# EAGLE design FillSensor (EAGLE 6.3)
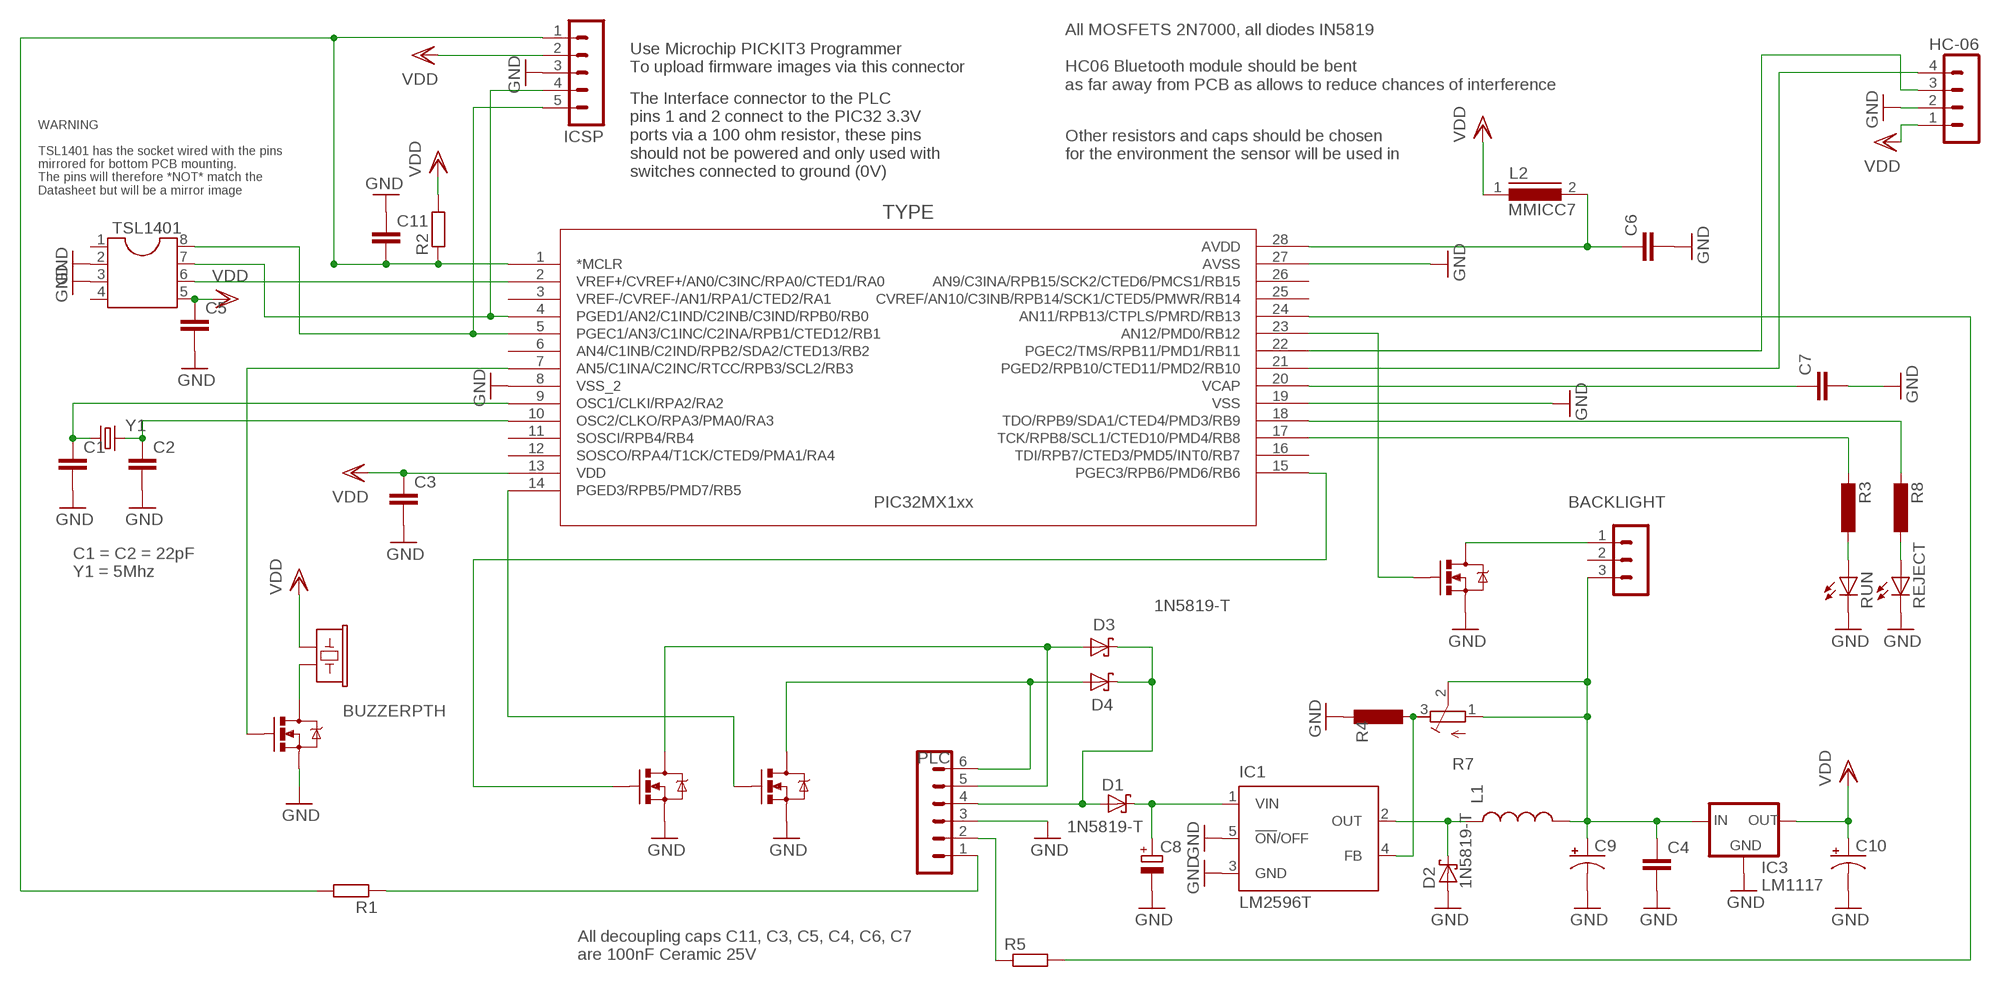
[diagram p0: schematic, sheet 1]

## Parts
BACKLIGHT  MA03-1  [MA03-1]
C1  CAPPTH  [CAP-PTH-SMALL]
C2  CAPPTH  [CAP-PTH-SMALL]
C3  CAPPTH  [CAP-PTH-SMALL]
C4  CAPPTH  [CAP-PTH-SMALL]
C5  CAPPTH  [CAP-PTH-SMALL]
C6  CAPPTH  [CAP-PTH-SMALL]
C7  CAPPTH  [CAP-PTH-SMALL]
C8  CPOL-EUE5-5  [E5-5]
C9  CAP_POLPTH2  [CPOL-RADIAL-10UF-25V]
C10  CAP_POLPTH2  [CPOL-RADIAL-10UF-25V]
C11  CAPPTH  [CAP-PTH-SMALL]
D1  1N5819-T  [DO41-7.6]
D2  1N5819-T  [DO41-7.6]
D3  1N5819-T  [DO41-7.6]
D4  1N5819-T  [DO41-7.6]
HC-06  MA04-1  [MA04-1]
IC1  LM2596T  [T05D]
IC3  LM1117  LM1117DTX-3.3  [TO252]
ICSP  MA05-1  [MA05-1]
L1  INDUCTORPWR  [CDRH125]
L2  MMICC7  [MMICC7]
PLC  MA06-1  [MA06-1]
Q1  MOSFET-NCHANNEL2N7000  [TO-92-AMMO]
Q2  MOSFET-NCHANNEL2N7000  [TO-92-AMMO]
Q3  MOSFET-NCHANNEL2N7000  [TO-92-AMMO]
Q4  MOSFET-NCHANNEL2N7000  [TO-92-AMMO]
R1  R-EU_0207/10  [0207/10]
R2  R-EU_0207/10  [0207/10]
R3  L-EU0207/10  [0207/10]
R4  L-EU0207/10  [0207/10]
R5  R-EU_0207/10  [0207/10]
R7  R-TRIMM64W  [RTRIM64W]
R8  L-EU0207/10  [0207/10]
REJECT  LED5MM  [LED5MM]
RUN  LED5MM  [LED5MM]
SG1  BUZZERPTH  [BUZZER-12MM]
TSL1401  DIL8  [DIL08]
U1  PIC32MX150F128B-  [SPDIP28_300MC]
Y1  CRYSTALHC49UV  [HC49U-V]

## Nets
GND: C1.2 C2.2 C3.2 C4.2 C5.2 C6.2 C7.2 C8.- C9.2(-) C10.2(-) C11.1 D2.A HC-06.2 IC1.3(GND) IC1.5(!ON!/OFF) IC3.1(GND) ICSP.3 PLC.3 Q1.1(S) Q2.1(S) Q3.1(S) Q4.1(S) R4.1 REJECT.K(C) RUN.K(C) TSL1401.2 TSL1401.3 U1.8(VSS_2) U1.19(VSS) U1.27(AVSS)
N$1: C1.1 U1.9(OSC1/CLKI/RPA2/RA2) Y1.1
N$2: C2.1 U1.10(OSC2/CLKO/RPA3/PMA0/RA3) Y1.2
N$3: C6.1 L2.2 U1.28(AVDD)
N$4: C11.2 ICSP.1 R1.2 R2.1 U1.1(*MCLR)
N$5: TSL1401.6 U1.2(VREF+/CVREF+/AN0/C3INC/RPA0/CTED1/RA0)
N$6: R3.1 RUN.A
N$7: ICSP.5 TSL1401.8 U1.5(PGEC1/AN3/C1INC/C2INA/RPB1/CTED12/RB1)
N$8: C7.1 U1.20(VCAP)
N$9: Q3.2(G) U1.23(AN12/PMD0/RB12)
N$11: R5.2 U1.24(AN11/RPB13/CTPLS/PMRD/RB13)
N$12: ICSP.4 TSL1401.7 U1.4(PGED1/AN2/C1IND/C2INB/C3IND/RPB0/RB0)
N$13: R8.1 REJECT.A
N$14: C8.+ D1.C IC1.1(VIN)
N$15: HC-06.3 U1.22(PGEC2/TMS/RPB11/PMD1/RB11)
N$16: IC1.4(FB) R4.2 R7.3(A)
N$18: D4.A PLC.6 Q1.3(D)
N$19: D3.A PLC.5 Q2.3(D)
N$20: Q2.2(G) U1.15(PGEC3/RPB6/PMD6/RB6)
N$21: Q1.2(G) U1.14(PGED3/RPB5/PMD7/RB5)
N$22: BACKLIGHT.3 C4.1 C9.1(+) IC3.2(IN) L1.2 R7.1(E) R7.2(S)
N$23: R3.2 U1.17(TCK/RPB8/SCL1/CTED10/PMD4/RB8)
N$24: R8.2 U1.18(TDO/RPB9/SDA1/CTED4/PMD3/RB9)
N$25: BACKLIGHT.1 Q3.3(D)
N$26: HC-06.4 U1.21(PGED2/RPB10/CTED11/PMD2/RB10)
N$27: Q4.3(D) SG1.-
N$28: Q4.2(G) U1.7(AN5/C1INA/C2INC/RTCC/RPB3/SCL2/RB3)
N$29: D1.A D3.C D4.C PLC.4
N$30: PLC.1 R1.1
N$31: PLC.2 R5.1
TH1: D2.C IC1.2(OUT) L1.1
VDD: C3.1 C5.1 C10.1(+) HC-06.1 IC3.TAB(OUT) ICSP.2 L2.1 R2.2 SG1.+ TSL1401.5 U1.13(VDD)
Unconnected: BACKLIGHT.2 TSL1401.1 TSL1401.4 U1.3(VREF-/CVREF-/AN1/RPA1/CTED2/RA1) U1.6(AN4/C1INB/C2IND/RPB2/SDA2/CTED13/RB2) U1.11(SOSCI/RPB4/RB4) U1.12(SOSCO/RPA4/T1CK/CTED9/PMA1/RA4) U1.16(TDI/RPB7/CTED3/PMD5/INT0/RB7) U1.25(CVREF/AN10/C3INB/RPB14/SCK1/CTED5/PMWR/RB14) U1.26(AN9/C3INA/RPB15/SCK2/CTED6/PMCS1/RB15)

## Notes on the sheet
- Use Microchip PICKIT3 Programmer
  To upload firmware images via this connector
- All MOSFETS 2N7000, all diodes IN5819
  
  HC06 Bluetooth module should be bent
  as far away from PCB as allows to reduce chances of interference
- Other resistors and caps should be chosen 
  for the environment the sensor will be used in
- The Interface connector to the PLC
  pins 1 and 2 connect to the PIC32 3.3V
  ports via a 100 ohm resistor, these pins
  should not be powered and only used with
  switches connected to ground (0V)
- WARNING
  
  TSL1401 has the socket wired with the pins 
  mirrored for bottom PCB mounting. 
  The pins will therefore *NOT* match the
  Datasheet but will be a mirror image
- PIC32MX1xx
- C1 = C2 = 22pF
  Y1 = 5Mhz
- All decoupling caps C11, C3, C5, C4, C6, C7
  are 100nF Ceramic 25V

## Library data of the parts
BACKLIGHT = con-lstb:MA03-1: PIN HEADER; OC_FARNELL: unknown; OC_NEWARK: unknown
C1-C7 C11 = SparkFun:CAP: Capacitor Standard 0603 ceramic capacitor, and 0.1" leaded capacitor.
C8 = rcl:CPOL-EU: POLARIZED CAPACITOR, European symbol
C9 C10 = SparkFun:CAP_POL: Capacitor Polarized These are standard SMD and PTH capacitors. Normally 10uF, 47uF, and 100uF in electrolytic and tantalum varieties. Always verify the external diameter of the through hole cap, it varies with capacity, voltage, and manufacturer. The EIA devices should be standard.
D1-D4 = diode:1N581*: 1.0A SCHOTTKY BARRIER RECTIFIER Source: http://www.diodes.com/datasheets/ds23001.pdf
HC-06 = con-lstb:MA04-1: PIN HEADER; OC_FARNELL: unknown; OC_NEWARK: unknown
IC1 = national-semiconductor:LM2596: SIMPLE SWITCHER® Power Converter 150 kHz 3A Step-Down Voltage Regulator Source: http://www.national.com/ds/LM/LM2596.pdf; MPN: LM2596T-ADJ/LF02; OC_FARNELL: 9494162; OC_NEWARK: 65K5910
IC3 = boznz:LM1117DTX-*
ICSP = con-lstb:MA05-1: PIN HEADER; OC_FARNELL: unknown; OC_NEWARK: unknown
L1 = SparkFun:INDUCTOR: Inductors Basic Inductor/Choke - 0603 and 1206. Footprints are not proven and vary greatly between part numbers.
L2 = inductors:MMICC7: INDUCTOR
PLC = con-lstb2:MA06-1: PIN HEADER; OC_FARNELL: unknown; OC_NEWARK: unknown
Q1-Q4 = SparkFun:MOSFET-NCHANNEL
R1 R2 R5 = rcl:R-EU_: RESISTOR, European symbol
R3 R4 R8 = rcl:L-EU: INDUCTOR, European symbol
R7 = resistor:R-TRIMM: Trimm resistor
REJECT RUN = SparkFun:LED: LEDs Standard schematic elements and footprints for 5mm, 3mm, 1206, and 0603 sized LEDs. 5mm - Spark Fun Electronics SKU : COM-00529 (and others)
SG1 = SparkFun:BUZZER: Buzzer 12mm Spark Fun Electronics SKU : Comp-Buzzer
TSL1401 = ic-package:DIL8: Dual In Line / Socket
U1 = boznz:PIC32MX150F128B-
Y1 = SparkFun:CRYSTAL: Crystals Various standard crystals. Proven footprints. Spark Fun Electronics SKU : COM-00534

## Board
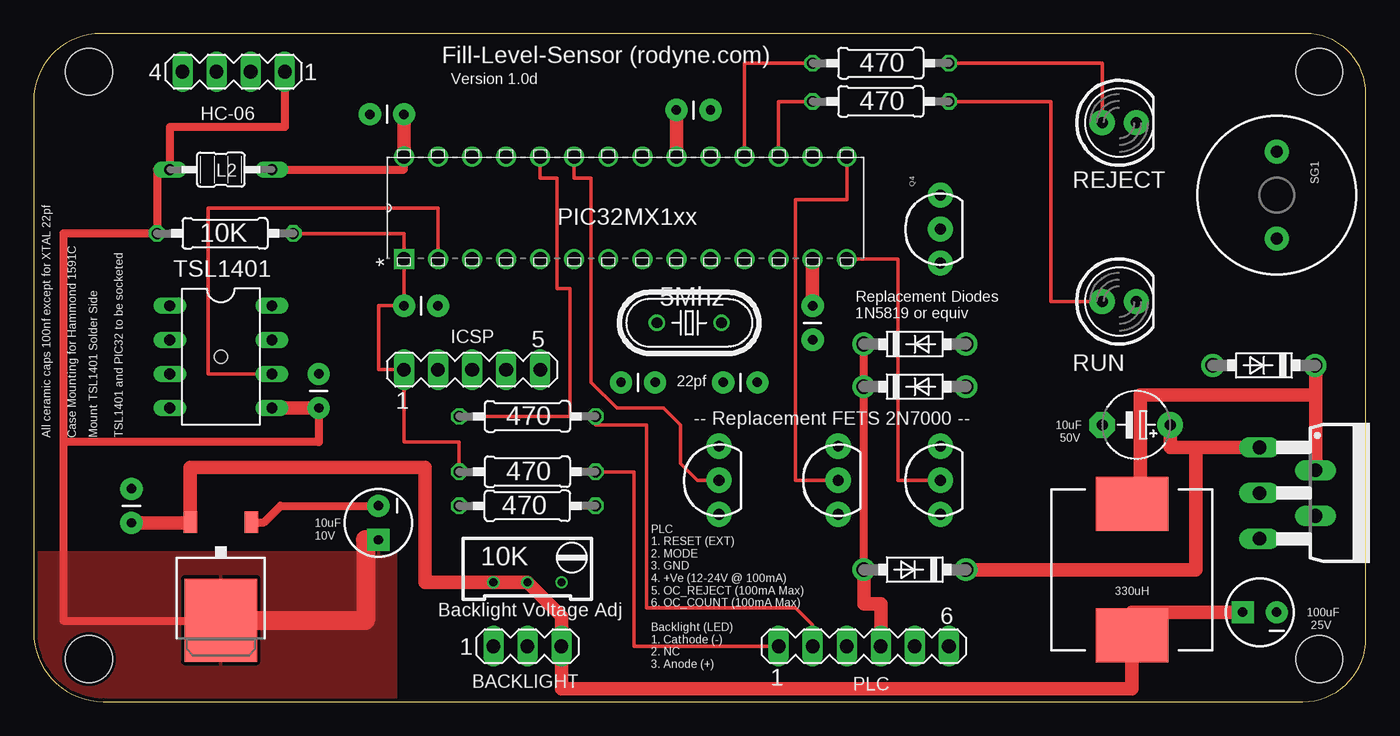
[diagram p1: board, top side]
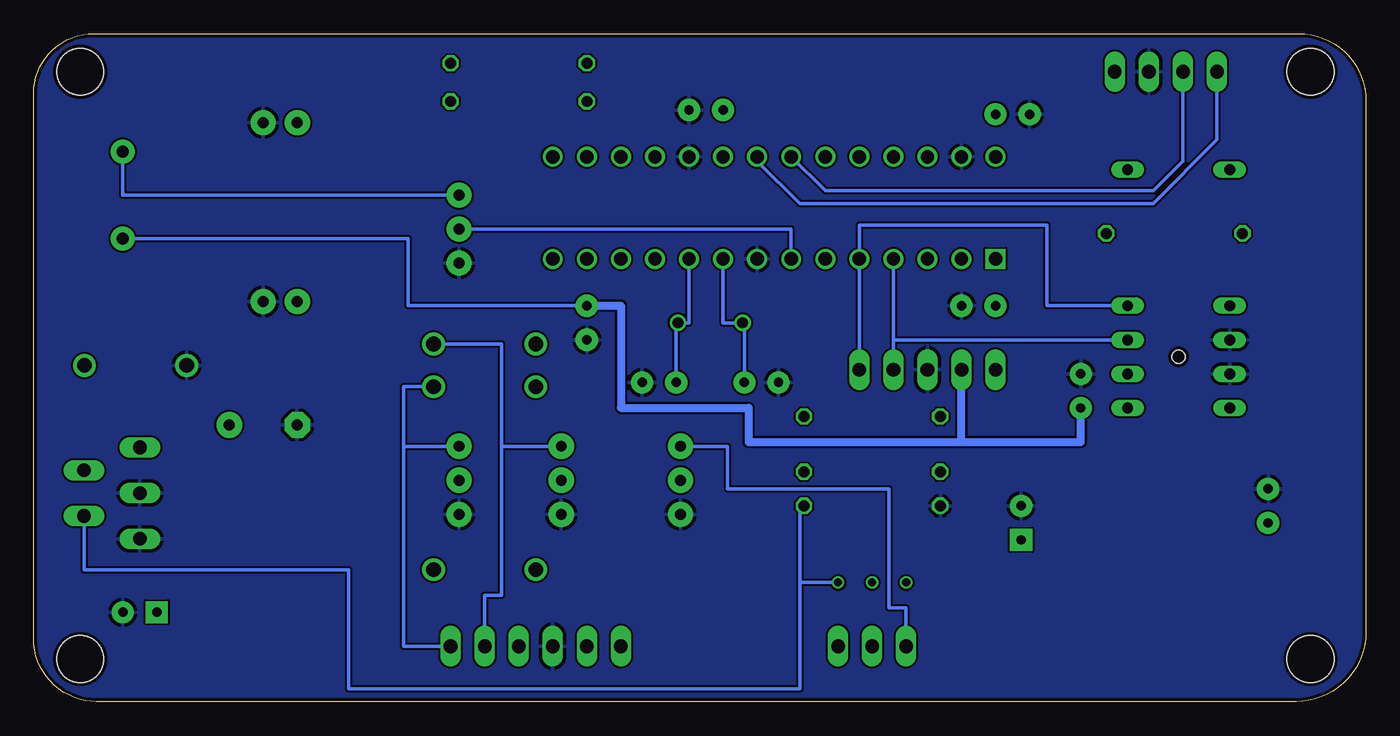
[diagram p2: board, bottom side, seen from below]

Size 99.36 x 49.84 mm. Coordinates in mm from the lower left corner, seen from the top.
Outline: 0,44.82 0,5.21 arc90 5.21,0 94.65,0 arc90 99.36,4.71 99.36,45.34 arc90 94.87,49.84 5.01,49.84 arc90 0,44.82
Copper layers (1*2*15*16): Top 0.035mm / dielectric 0.2mm / layer 2 0.0175mm / dielectric 1.1mm / layer 15 0.0175mm / dielectric 0.2mm / Bottom 0.035mm
Design rules "SeeedStudio_DRU_no_angle_20130527": minimum track width 6mil, minimum drill 12mil, track to track 6mil, track to pad 6mil, pad to pad 6mil, via to via 6mil, smd to smd 0mil, copper to edge 10mil, drill to drill 10mil, minimum pad ring 6mil, minimum via ring 6mil, stop-mask expansion 2mil, vias tented up to drill 25mil, thermal gap 10mil
Holes 3.5 mm at 4.13,46.99 4.13,3.17 95.89,3.17 95.89,46.99
Holes 1 mm at 13.97,25.72

### Footprints (pad centres in the part's own frame; a part is rotated, then mirrored left to right if it is on the bottom)
MA03-1 = drill 1.016 long: 1 -2.54,0; 2 0,0; 3 2.54,0
CAP-PTH-SMALL = drill 0.7 pad 1.651: 1 0,0; 2 2.54,0
E5-5 = drill 0.813 pad 1.905: + -2.54,0 | drill 0.813 pad 1.905 octagon: - 2.54,0
CPOL-RADIAL-10UF-25V = drill 0.7 pad 1.651 square: 1 1.27,0 | drill 0.7 pad 1.651: 2 -1.27,0
DO41-7.6 = drill 1.1 pad 1.7: A 3.81,0; C -3.81,0
MA04-1 = drill 1.016 long: 1 -3.81,0; 2 -1.27,0; 3 1.27,0; 4 3.81,0
T05D = drill 1.016 long: 1 -3.404,-5.08; 2 -1.702,-0.914; 3 0,-5.08; 4 1.702,-0.914; 5 3.404,-5.08
TO252 = smd 1 x 1.6: 1 -2.28,-4.8; 2 2.28,-4.8 | smd 5.4 x 6.2: TAB 0,2.5
MA05-1 = drill 1.016 long: 1 -5.08,0; 2 -2.54,0; 3 0,0; 4 2.54,0; 5 5.08,0
CDRH125 = smd 5.4 x 4: 1 0,4.9; 2 0,-4.9
MMICC7 = drill 0.813 long: 1 -3.81,0; 2 3.81,0
MA06-1 = drill 1.016 long: 1 -6.35,0; 2 -3.81,0; 3 -1.27,0; 4 1.27,0; 5 3.81,0; 6 6.35,0
TO-92-AMMO = drill 0.813 pad 1.88: 1 -2.54,0; 2 0,0; 3 2.54,0
0207/10 = drill 0.813 octagon: 1 -5.08,0; 2 5.08,0
RTRIM64W = drill 0.61: 1 1.27,-2.54; 2 1.27,0; 3 1.27,2.54
LED5MM = drill 0.813 pad 1.88: A -1.27,0; K 1.27,0
BUZZER-12MM = drill 0.9 pad 1.778: + 3.25,0; - -3.25,0
DIL08 = drill 0.813 long: 1 -3.81,-3.81; 2 -1.27,-3.81; 3 1.27,-3.81; 4 3.81,-3.81; 5 3.81,3.81; 6 1.27,3.81; 7 -1.27,3.81; 8 -3.81,3.81
SPDIP28_300MC = drill 0.991 square: 1 -7.62,33.02 | drill 0.991: 2 -7.62,30.48; 3 -7.62,27.94; 4 -7.62,25.4; 5 -7.62,22.86; 6 -7.62,20.32; 7 -7.62,17.78; 8 -7.62,15.24; 9 -7.62,12.7; 10 -7.62,10.16; 11 -7.62,7.62; 12 -7.62,5.08; 13 -7.62,2.54; 14 -7.62,0; 15 0,0; 16 0,2.54; 17 0,5.08; 18 0,7.62; 19 0,10.16; 20 0,12.7; 21 0,15.24; 22 0,17.78; 23 0,20.32; 24 0,22.86; 25 0,25.4; 26 0,27.94; 27 0,30.48; 28 0,33.02
HC49U-V = drill 0.813: 1 -2.413,0; 2 2.413,0

### Placement (x,y rotation side)
BACKLIGHT  36.83,4.13 0 top
C1  46.35,23.81 180 top
C2  51.44,23.81 0 top
C3  58.1,29.53 270 top
C4  7.3,13.34 90 top
C5  21.27,21.91 90 top
C6  27.62,43.82 180 top
C7  47.94,44.13 0 top
C8  82.23,20.64 180 top
C9  91.44,6.67 180 top
C10  25.72,13.34 270 top
C11  30.16,29.53 180 top
D1  65.72,9.84 180 top
D2  91.76,25.08 180 top
D3  65.72,26.67 0 top
D4  65.72,23.49 0 top
HC-06  14.92,46.99 180 top
IC1  96.52,15.56 270 top
IC3  13.97,8.57 180 top
ICSP  32.7,24.77 0 top
L1  81.92,9.84 0 top
L2  13.97,39.69 0 top
PLC  61.91,4.13 0 top
Q1  67.63,16.51 90 top
Q2  60.01,16.51 90 top
Q3  51.12,16.51 90 top
Q4  67.63,35.24 90 top
R1  36.83,17.14 180 top
R2  14.29,34.93 180 top
R3  63.18,44.77 180 top
R4  36.83,14.61 0 top
R5  36.83,21.27 180 top
R7  36.83,10.16 270 top
R8  63.18,47.62 180 top
REJECT  80.96,43.18 0 top
RUN  80.96,29.84 0 top
SG1  92.71,37.78 270 top
TSL1401  13.97,25.72 270 top
U1  60.64,40.64 90 top
Y1  48.9,28.26 0 top

### Tracks (layer width: path | path; a pad name or v marks a point on that pad's centre or on a via)
GND
  Top 0.61: IC3.1 17.18,13.37 18.41,14.6 C10.2
  pour Bottom: 0,0.32 99.38,0.32 99.38,49.53 0,49.53
N$1
  Bottom 0.254: U1.9 47.94,28.26 Y1.1 46.35,28.26 C1.1
N$2
  Bottom 0.254: U1.10 50.48,28.26 Y1.2 51.44,28.26 C2.1
N$3
  Top 0.61: L2.2 27.62,39.69 U1.28
  Top 1.016: U1.28 C6.1
N$4
  Top 0.254: R2.1 27.62,34.93 U1.1 C11.2 25.72,29.53 25.72,24.77 ICSP.1 27.62,19.37 31.75,19.37 R1.2
N$5
  Top 0.254: TSL1401.6 13.02,24.45 13.02,36.83 30.16,36.83 U1.2
N$6
  Top 0.254: R3.1 75.88,44.77 75.88,29.84 RUN.A
N$7
  Bottom 0.254: ICSP.5 U1.5 37.78,35.56 23.81,35.56 23.81,29.53 TSL1401.8
N$8
  Top 1.016: U1.20 C7.1
N$9
  Top 0.254: U1.23 40.32,39.05 41.59,39.05 41.59,23.81 43.5,21.91 46.99,21.91 48.26,20.64 48.26,17.78 49.53,16.51 Q3.2
N$11
  Top 0.254: R5.2 40.01,21.27 40.01,30.8 39.05,30.8 39.05,39.05 37.78,39.05 U1.24
N$12
  Bottom 0.254: U1.4 35.24,26.99 | ICSP.4 35.24,26.99 | 35.24,26.99 TSL1401.7
N$13
  Top 0.254: R8.1 79.69,47.62 REJECT.A
N$14
  Top 1.016: IC1.1 86.68,18.96 | 86.68,18.96 84.77,18.96 C8.+ | D1.C 86.68,9.84 86.68,18.96
N$15
  Bottom 0.254: HC-06.3 13.65,40.32 15.88,38.1 40.32,38.1 U1.22
N$16
  Bottom 0.254: IC1.4 95.57,13.86 95.57,9.84 75.88,9.84 75.88,0.95 42.23,0.95 42.23,8.89 | 42.23,8.89 R7.3 | R4.2 42.23,14.6 42.23,8.89
N$18
  Bottom 0.254: 71.75,19.05 71.75,4.13 PLC.6 | 71.75,19.05 Q1.3 | D4.A 71.75,23.49 71.75,19.05
N$19
  Bottom 0.254: 64.45,19.05 Q2.3 | D3.A 64.45,26.67 64.45,19.05 | 64.45,19.05 64.45,7.94 65.72,7.94 PLC.5
N$20
  Top 0.254: U1.15 60.64,37.47 56.83,37.47 56.83,16.51 Q2.2
N$21
  Top 0.254: U1.14 64.45,33.02 64.45,16.51 Q1.2
N$22
  Top 1.016: C9.1 81.92,6.67 L1.2 81.92,0.95 39.37,0.95 BACKLIGHT.3 39.37,6.35 R7.2 R7.1 29.21,8.89 29.21,17.46 11.69,17.46 IC3.2 11.69,13.34 C4.1
N$23
  Top 0.254: R3.2 55.56,44.77 U1.17
N$24
  Top 0.254: U1.18 53.02,47.62 R8.2
N$25
  Bottom 0.254: Q3.3 47.62,19.05 47.62,15.87 35.56,15.87 35.56,6.99 34.29,6.99 BACKLIGHT.1
N$26
  Bottom 0.254: U1.21 45.4,40.32 42.23,37.15 15.88,37.15 11.11,41.91 HC-06.4
N$27
  Bottom 0.254: Q4.3 92.71,37.78 SG1.-
N$28
  Bottom 0.254: Q4.2 42.86,35.24 U1.7
N$29
  Top 0.61: D1.A D4.C D3.C
  Top 1.016: D1.A 61.91,7.3 63.18,7.3 PLC.4
N$30
  Top 0.254: R1.1 44.77,17.15 44.77,4.13 PLC.1
N$31
  Top 0.254: PLC.2 58.1,5.71 56.83,6.99 45.72,6.99 45.72,20.64 41.91,20.64 R5.1
TH1
  Top 1.016: D2.C 95.61,25.08 95.61,22.86 | 95.61,22.86 IC1.2 | L1.1 82.55,14.74 82.55,22.86 95.61,22.86
VDD
  Top 0.61: 2.22,19.37 2.22,34.93 R2.2 9.21,39.69 L2.1 10.16,42.86 18.73,42.86 HC-06.1 | 2.22,19.37 2.22,6.03 13.97,6.03 | C5.1 21.27,19.37 2.22,19.37
  Top 1.016: TSL1401.5 C5.1 | C3.1 U1.13
  Top 1.422: C10.1 24.77,12.07 24.77,6.03 13.97,6.03 IC3.TAB
  Bottom 0.254: SG1.+ 71.44,34.53 71.44,29.53 C3.1
  Bottom 0.61: C3.1 55.56,29.53 55.56,21.91 46.04,21.91 46.04,19.37 30.16,19.37 | 30.16,19.37 ICSP.2 | 30.16,19.37 21.27,19.37 C5.1
  pour Top: 0,11.11 26.99,11.11 26.99,-0.32 0,-0.32

### Text on the board
tPlace: Fill-Level-Sensor (rodyne.com) | Backlight Voltage Adj | PLC / 1. RESET (EXT) / 2. MODE / 3. GND / 4. +Ve (12-24V @ 100mA) / 5. OC_REJECT (100mA Max) / 6. OC_COUNT (100mA Max) / / Backlight (LED) / 1. Cathode (-) / 2. NC / 3. Anode (+)
tNames: 470 | Version 1.0d | 470 | 10K | 5Mhz | Replacement Diodes / 1N5819 or equiv | 22pf | 470 | -- Replacement FETS 2N7000 -- | 10uF | All ceramic caps 100nf except for XTAL 22pf | Case Mounting for Hammond 1591C | Mount TSL1401 Solder Side | TSL1401 and PIC32 to be socketed | 50V | 470 | 470 | 10uF | 10V | 10K | 330uH | 100uF | 25V